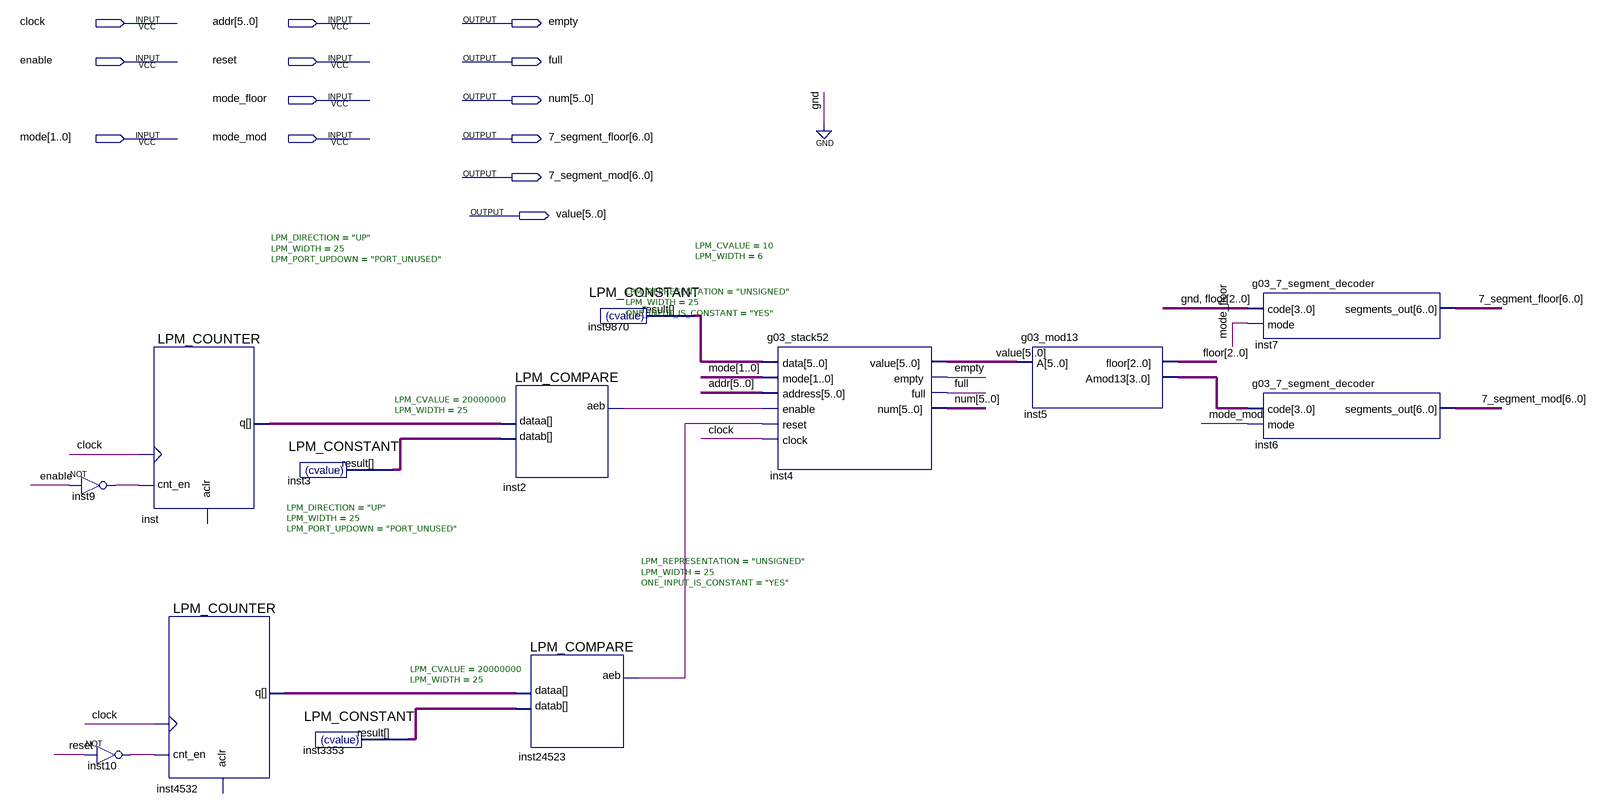
[diagram p0: schematic sheet]
// Quartus schematic g03_testbed.bdf as structural Verilog: 13 symbols, 13 pins
module g03_testbed (
  input  clock,
  input  [5:0] addr,
  input  enable,
  input  reset,
  input  mode_floor,
  input  [1:0] mode,
  input  mode_mod,
  output empty,
  output full,
  output [5:0] num,
  output [6:0] \7_segment_floor ,
  output [6:0] \7_segment_mod ,
  output [5:0] value
);

  wire inst2_aeb, inst9_out, inst10_out, inst24523_aeb;
  wire [2:0] floor;
  wire [3:0] inst5_amod13;
  wire [5:0] inst9870_result;
  wire [24:0] inst3_result, inst3353_result, inst4532_q, inst_q;

  not inst9 (inst9_out, enable);
  not inst10 (inst10_out, reset);
  LPM_COUNTER #(.LPM_DIRECTION("UP"), .LPM_WIDTH(25), .LPM_PORT_UPDOWN("PORT_UNUSED")) inst (
    .clock(clock), .cnt_en(inst9_out), .q(inst_q));  // open: aclr
  LPM_COUNTER #(.LPM_DIRECTION("UP"), .LPM_WIDTH(25), .LPM_PORT_UPDOWN("PORT_UNUSED")) inst4532 (
    .clock(clock), .cnt_en(inst10_out), .q(inst4532_q));  // open: aclr
  LPM_CONSTANT #(.LPM_CVALUE(20000000), .LPM_WIDTH(25)) inst3 (.result(inst3_result));
  LPM_CONSTANT #(.LPM_CVALUE(20000000), .LPM_WIDTH(25)) inst3353 (.result(inst3353_result));
  LPM_COMPARE #(.LPM_REPRESENTATION("UNSIGNED"), .LPM_WIDTH(25), .ONE_INPUT_IS_CONSTANT("YES")) inst2 (
    .dataa(inst_q), .datab(inst3_result), .aeb(inst2_aeb));
  LPM_COMPARE #(.LPM_REPRESENTATION("UNSIGNED"), .LPM_WIDTH(25), .ONE_INPUT_IS_CONSTANT("YES")) inst24523 (
    .dataa(inst4532_q), .datab(inst3353_result), .aeb(inst24523_aeb));
  LPM_CONSTANT #(.LPM_CVALUE(10), .LPM_WIDTH(6)) inst9870 (.result(inst9870_result));
  g03_stack52 inst4 (
    .data(inst9870_result), .mode(mode), .address(addr), .enable(inst2_aeb), .reset(inst24523_aeb),
    .clock(clock), .value(value), .empty(empty), .full(full), .num(num));
  g03_mod13 inst5 (.A(value), .floor(floor), .Amod13(inst5_amod13));
  g03_7_segment_decoder inst7 (.code({1'b0, floor}), .mode(mode_floor), .segments_out(\7_segment_floor ));
  g03_7_segment_decoder inst6 (.code(inst5_amod13), .mode(mode_mod), .segments_out(\7_segment_mod ));
endmodule
